# EAGLE schematic transciever (EAGLE 9.0.1)
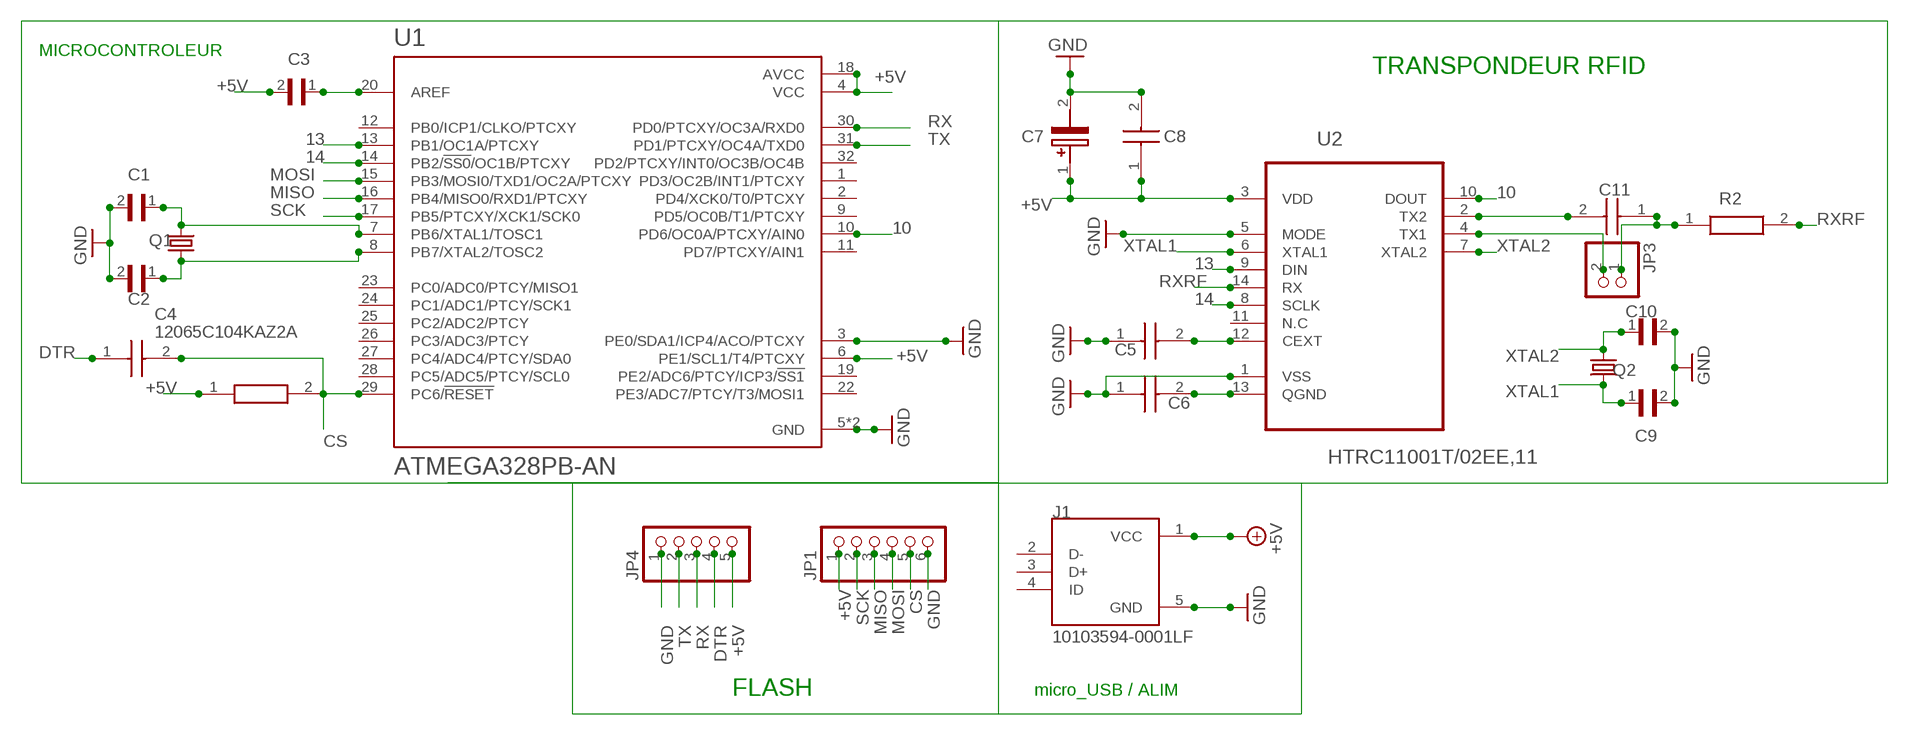
[diagram p0: schematic, sheet 1]

## Parts
C1  06031U220GAT2A  [CAPC1608X90]
C2  06031U220GAT2A  [CAPC1608X90]
C3  GRT31CC80J476KE13L  [CAP3216X125N]
C4  12065C104KAZ2A  [CAPC3216X94N]
C5  12065C104KAZ2A  [CAPC3216X94N]
C6  12065C104KAZ2A  [CAPC3216X94N]
C7  NACE100M16V4X5.5TR13F  [NACE(4X5.5)]
C8  12065C104KAZ2A  [CAPC3216X94N]
C9  06031U220GAT2A  [CAPC1608X90]
C10  06031U220GAT2A  [CAPC1608X90]
C11  12065C104KAZ2A  [CAPC3216X94N]
J1  10103594-0001LF  [FCI_10103594-0001LF]
JP1  PINHD-1X6  [1X06]
JP3  PINHD-1X2  [1X02]
JP4  PINHD-1X5  [1X05]
Q1  KX-K  [11.4X4.5]
Q2  KX-K  [11.4X4.5]
R1  CRCW12061K00FKEA  [RESC3216X60N]
R2  CRCW12061K00FKEA  [RESC3216X60N]
U1  ATMEGA328PB-AN  [QFP80P900X900X120-32N]
U2  HTRC11001T/02EE,11  [SOIC127P600X175-14N]

## Nets
10: U1.10(PD6/OC0A/PTCXY/AIN0) U2.10(DOUT)
13: U1.13(PB1/OC1A/PTCXY) U2.9(DIN)
14: U1.14(PB2/!SS0!/OC1B/PTCXY) U2.8(SCLK)
+5V: C3.2 C7.1(+) C8.1 J1.1(VCC) JP1.1 JP4.5 R1.1 U1.4(VCC) U1.6(PE1/SCL1/T4/PTCXY) U1.18(AVCC) U2.3(VDD)
CS: C4.2 JP1.5 R1.2 U1.29(PC6/!RESET)
DTR: C4.1 JP4.4
GND: C1.2 C2.2 C5.1 C6.1 C7.2(-) C8.2 C9.2 C10.2 J1.5(GND) JP1.6 JP4.1 U1.3(PE0/SDA1/ICP4/ACO/PTCXY) U1.5(GND) U1.21(GND) U2.1(VSS) U2.5(MODE)
MISO: JP1.3 U1.16(PB4/MISO0/RXD1/PTCXY)
MOSI: JP1.4 U1.15(PB3/MOSI0/TXD1/OC2A/PTCXY)
N$1: C1.1 Q1.2 U1.7(PB6/XTAL1/TOSC1)
N$2: C2.1 Q1.1 U1.8(PB7/XTAL2/TOSC2)
N$4: C3.1 U1.20(AREF)
N$7: C11.2 U2.2(TX2)
N$8: C5.2 U2.12(CEXT)
N$9: C11.1 JP3.1 R2.1
N$10: C6.2 U2.13(QGND)
N$11: JP3.2 U2.4(TX1)
RX: JP4.3 U1.30(PD0/PTCXY/OC3A/RXD0)
RXRF: R2.2 U2.14(RX)
SCK: JP1.2 U1.17(PB5/PTCXY/XCK1/SCK0)
TX: JP4.2 U1.31(PD1/PTCXY/OC4A/TXD0)
XTAL1: C9.1 Q2.2 U2.6(XTAL1)
XTAL2: C10.1 Q2.1 U2.7(XTAL2)
Unconnected: J1.2(D-) J1.3(D+) J1.4(ID) U1.1(PD3/OC2B/INT1/PTCXY) U1.2(PD4/XCK0/T0/PTCXY) U1.9(PD5/OC0B/T1/PTCXY) U1.11(PD7/PTCXY/AIN1) U1.12(PB0/ICP1/CLKO/PTCXY) U1.19(PE2/ADC6/PTCY/ICP3/!SS1) U1.22(PE3/ADC7/PTCY/T3/MOSI1) U1.23(PC0/ADC0/PTCY/MISO1) U1.24(PC1/ADC1/PTCY/SCK1) U1.25(PC2/ADC2/PTCY) U1.26(PC3/ADC3/PTCY) U1.27(PC4/ADC4/PTCY/SDA0) U1.28(PC5/ADC5/PTCY/SCL0) U1.32(PD2/PTCXY/INT0/OC3B/OC4B) U2.11(N.C)

## Notes on the sheet
- MICROCONTROLEUR
- TRANSPONDEUR RFID
- FLASH | micro_USB / ALIM

## Library data of the parts
C1 C2 C9 C10 = SnapEDA-Library:06031U220GAT2A: CAP CER 22PF 100V C0G/NP0 0603
C3 = SnapEDA-Library:GRT31CC80J476KE13L: 47UF 6.3V X6S 1206
C4-C6 C8 C11 = SamacSys_Parts:12065C104KAZ2A: AVX 100nF /-10% 50V dc X7R Dielectric SMD Ceramic Multilayer Capacitor 1206 Source: Datasheet <https://componentsearchengine.com/Datasheets/3/12065C104KAZ2A.pdf>; ALLIED_NUMBER: 70473529; DESCRIPTION: AVX 100nF /-10% 50V dc X7R Dielectric SMD Ceramic Multilayer Capacitor 1206; HEIGHT: 0.94mm; MANUFACTURER_NAME: AVX; MANUFACTURER_PART_NUMBER: 12065C104KAZ2A; RS_PART_NUMBER: 6983673
C7 = SamacSys_Parts:NACE100M16V4X5.5TR13F: NIC Components 10F 16 V dc Aluminium Electrolytic Capacitor, NACE Series 2000h 4 Dia. x 5.5mm Source: Datasheet <http://uk.rs-online.com/web/p/products/7379625P>; DESCRIPTION: NIC Components 10F 16 V dc Aluminium Electrolytic Capacitor, NACE Series 2000h 4 Dia. x 5.5mm; HEIGHT: mm; MANUFACTURER_NAME: NIC Components; MANUFACTURER_PART_NUMBER: NACE100M16V4X5.5TR13F; RS_PART_NUMBER: 7379625P
J1 = SnapEDA-Library:10103594-0001LF: Conn Micro USB Type B RCP 5 POS 0.65mm Solder RA SMD 5 Terminal 1 Port T/R; MANUFACTURER: Framatome
JP1 = pinhead:PINHD-1X6: PIN HEADER
JP3 = pinhead:PINHD-1X2: PIN HEADER
JP4 = pinhead:PINHD-1X5: PIN HEADER
Q1 Q2 = crystal-geyer_V1_0:KX: Quartz Crystals (MHz) SMD: KX - Serie Model Size l/w/h [mm] Frequency Range Frequency Stability Temp. Range [°C] Load Capacitance AECQ 200 availabel Datasheet KX-4 KX-5 KX-6 KX-7 KX-9A KX-9B KX-12A KX-12B KX-13 KX-20 KX-K KX-KS 1.6/1.2/0.3 2.0/1.6/0.45 2.5/2.0/0.55 3.2/2.5/0.8 5.0/3.2/1.0 5.0/3.2/1.1 6.0/3.5/1.1 6.0/3.5/1.0 7.0/5.0 /1.3 11.6/5.5/1.6 12.3/4.5/4.2 12.3/4.5/3.2 24.0 ~ 80.0 MHz 16.0 ~ 80.0 MHz 12.0 ~ 80.0 MHz 8.0 ~ 60.0 MHz 7,68 ~ 300,0 MHz 8,0 ~ 50,0 MHz 8,0 ~ 150,0 MHz 8,0 ~ 50,0 MHz 6,0 ~ 160,0 MHz 3,579 ~ 25,0 MHz 3,579 ~ 70,0 MHz 3,579 ~ 70,0 MHz ±10 … ±50ppm ±10 … ±50ppm ±10 … ±50ppm ±10 … ±50ppm ±10 … ±50ppm ±10 … ±50ppm ±10 … ±50ppm ±10 … ±50ppm ±10 … ±50ppm ±50ppm ±10 … ±50ppm ±10 … ±50ppm (*) -40°C …+85°C (*) -40°C …+125°C (*) -40°C …+125°C (*) -40°C …+125°C (*) -40°C …+105°C (*) -40°C …+105°C (*) -40°C …+125°C (*) -40°C …+105°C (*) -40°C …+105°C (*) -40°C …+105°C (*) -40°C …+85°C (*) -40°C …+85°C 8, 8…16 8, 8…16 10, 8…16 12, 7…20 16, 10…20 16, 10…20 16, 10…20 16, 12…20 16, 12…20 16, 12…20 16, 12…30 16, 12…30 - yes yes yes - - - - - - - - KX-4.pdf <http://www.geyer-electronic.de/uploads/tx_userartikelfrequenz/GEYER-KX-4.pdf> KX-5.pdf <http://www.geyer-electronic.de/uploads/tx_userartikelfrequenz/GEYER-KX-5.pdf> KX-6.pdf <http://www.geyer-electronic.de/uploads/tx_userartikelfrequenz/GEYER-KX-6.pdf> KX-7.pdf <http://www.geyer-electronic.de/uploads/tx_userartikelfrequenz/GEYER-KX-7.pdf> KX-9A.pdf <http://www.geyer-electronic.de/uploads/tx_userartikelfrequenz/GEYER-KX-9A.pdf> KX-9B.pdf <http://www.geyer-electronic.de/uploads/tx_userartikelfrequenz/GEYER-KX-9B.pdf> KX-12A.pdf <http://www.geyer-electronic.de/uploads/tx_userartikelfrequenz/GEYER-KX-12A.pdf> KX-12B.pdf <http://www.geyer-electronic.de/uploads/tx_userartikelfrequenz/GEYER-KX-12B.pdf> KX-13.pdf <http://www.geyer-electronic.de/uploads/tx_userartikelfrequenz/GEYER-KX-13.pdf> KX-20.pdf <http://www.geyer-electronic.de/uploads/tx_userartikelfrequenz/GEYER-KX-20.pdf> KX-K.pdf <http://www.geyer-electronic.de/uploads/tx_userartikelfrequenz/GEYER-KX-K.pdf> KX-KS.pdf <http://www.geyer-electronic.de/uploads/tx_userartikelfrequenz/GEYER-KX-KS.pdf> <http://www.geyer-electronic.de/fileadmin/template/img/logo-geyer-electronic.png> Details see: http://www.geyer-electronic.de/Frequenz-Produkte.9.0.html Created 2016-06-07, Hans Locher 2016 (C) Geyer Quartz Technology KX4,KX5,KX6,KX7,KX9A,KX9B,KX12A,KX12B,KX13,KX20,KXK,KXKS;1612;2016;2520;3225;5032;6035;7050;11655;12345;1,6x1,2;2,0x1,6;2,5x2,0;3,2x2,5;5,0x3,2;6,0x3,5;7,0x5,0;11,6x5,5;12,3x4,5;12,3x4,5;1.6x1.2;2.0x1.6;2.5x2.0;3.2x2.5;5.0x3.2;6.0x3.5;7.0x5.0;11.6x5.5;12.3x4.5;12.3x4.5;
R1 R2 = SamacSys_Parts:CRCW12061K00FKEA: CRCW1206 Resistor T/R 0.25W,1%,1K Vishay CRCW Series Thick Film Surface Mount Resistor 1206 Case 1k 1% 0.25W 100ppm/C Source: Datasheet <http://uk.rs-online.com/web/p/products/1694817>; ALLIED_NUMBER: 70204306; DESCRIPTION: CRCW1206 Resistor T/R 0.25W,1%,1K Vishay CRCW Series Thick Film Surface Mount Resistor 1206 Case 1k 1% 0.25W 100ppm/C; HEIGHT: 0.6mm; MANUFACTURER_NAME: Vishay; MANUFACTURER_PART_NUMBER: CRCW12061K00FKEA; RS_PART_NUMBER: 1694817
U1 = SnapEDA-Library:ATMEGA328PB-AN: AVR microcontroller; EEPROM: 1024B; SRAM: 2kB; Flash: 32kB; TQFP32; DESCRIPTION: AVR microcontroller; EEPROM: 1024B; SRAM: 2kB; Flash: 32kB; TQFP32; MANUFACTURER: Microchip; PACKAGE: TQFP-32 Microchip; PARTREV: D; STANDARD: IPC 7351B
U2 = SnapEDA-Library:HTRC11001T/02EE,11: HITAG reader chip; MPN: HTRC11001T/02EE,11; OC_FARNELL: -; OC_NEWARK: 70R5371; PACKAGE: SOIC-14; SUPPLIER: NXP